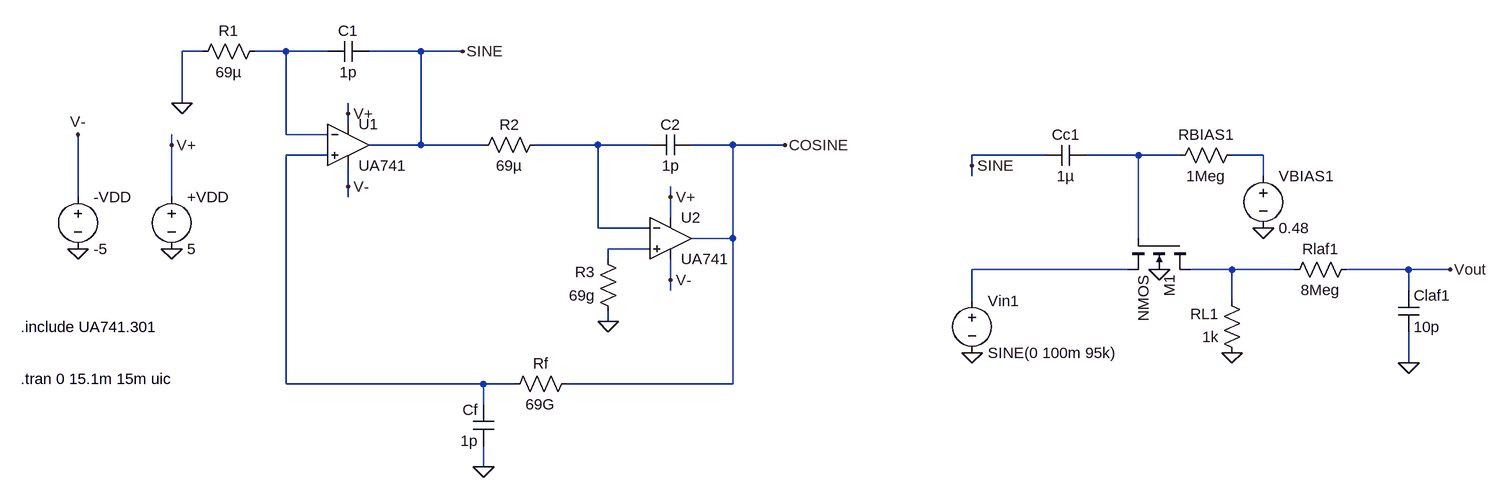
[diagram p0: schematic working!!!.asc]
working!!!.asc, the LTspice schematic file:
Version 4
SHEET 1 1844 704
WIRE -144 48 -176 48
WIRE -16 48 -64 48
WIRE 48 48 -16 48
WIRE 192 48 112 48
WIRE 256 48 192 48
WIRE -176 128 -176 48
WIRE 80 144 80 128
WIRE 80 160 80 144
WIRE -16 176 -16 48
WIRE 48 176 -16 176
WIRE -192 192 -192 176
WIRE 192 192 192 48
WIRE 192 192 112 192
WIRE 288 192 192 192
WIRE 464 192 368 192
WIRE 544 192 464 192
WIRE 672 192 608 192
WIRE 752 192 672 192
WIRE 48 208 -16 208
WIRE 1152 208 1040 208
WIRE 1296 208 1216 208
WIRE 1360 208 1296 208
WIRE 1488 208 1440 208
WIRE 1040 224 1040 208
WIRE 1040 240 1040 224
WIRE 1488 240 1488 208
WIRE 80 256 80 224
WIRE -336 272 -336 176
WIRE -192 272 -192 192
WIRE 80 272 80 256
WIRE 576 272 576 256
WIRE 576 304 576 272
WIRE 464 320 464 192
WIRE 544 320 464 320
WIRE 672 336 672 192
WIRE 672 336 608 336
WIRE 1296 336 1296 208
WIRE 544 352 480 352
WIRE 480 368 480 352
WIRE 1280 384 1040 384
WIRE 1440 384 1376 384
WIRE 1536 384 1440 384
WIRE 1712 384 1616 384
WIRE 1776 384 1712 384
WIRE 576 400 576 368
WIRE 576 416 576 400
WIRE 1712 416 1712 384
WIRE 1040 432 1040 384
WIRE 1440 432 1440 384
WIRE 480 464 480 448
WIRE 1712 528 1712 480
WIRE -16 560 -16 208
WIRE 288 560 -16 560
WIRE 336 560 288 560
WIRE 672 560 672 336
WIRE 672 560 416 560
WIRE 288 592 288 560
WIRE 288 688 288 656
FLAG 288 688 0
FLAG -176 128 0
FLAG -336 352 0
FLAG -192 352 0
FLAG 256 48 SINE
FLAG 752 192 COSINE
FLAG 480 464 0
FLAG -336 176 V-
FLAG -192 192 V+
FLAG 80 144 V+
FLAG 80 256 V-
FLAG 576 272 V+
FLAG 576 400 V-
FLAG 1488 320 0
FLAG 1040 512 0
FLAG 1328 384 0
FLAG 1440 512 0
FLAG 1712 528 0
FLAG 1776 384 Vout
FLAG 1040 224 SINE
SYMBOL cap 112 32 R90
WINDOW 0 0 32 VBottom 2
WINDOW 3 32 32 VTop 2
SYMATTR InstName C1
SYMATTR Value 1p
SYMBOL cap 608 176 R90
WINDOW 0 0 32 VBottom 2
WINDOW 3 32 32 VTop 2
SYMATTR InstName C2
SYMATTR Value 1p
SYMBOL cap 304 656 R180
WINDOW 0 24 56 Left 2
WINDOW 3 24 8 Left 2
SYMATTR InstName Cf
SYMATTR Value 1p
SYMBOL res -48 32 R90
WINDOW 0 0 56 VBottom 2
WINDOW 3 32 56 VTop 2
SYMATTR InstName R1
SYMATTR Value 69µ
SYMBOL res 384 176 R90
WINDOW 0 0 56 VBottom 2
WINDOW 3 32 56 VTop 2
SYMATTR InstName R2
SYMATTR Value 69µ
SYMBOL res 496 464 R180
WINDOW 0 36 76 Left 2
WINDOW 3 36 40 Left 2
SYMATTR InstName R3
SYMATTR Value 69g
SYMBOL res 432 544 R90
WINDOW 0 0 56 VBottom 2
WINDOW 3 32 56 VTop 2
SYMATTR InstName Rf
SYMATTR Value 69G
SYMBOL voltage -336 256 R0
SYMATTR InstName -VDD
SYMATTR Value -5
SYMBOL voltage -192 256 R0
SYMATTR InstName +VDD
SYMATTR Value 5
SYMBOL OpAmps/opamp2 80 128 R0
SYMATTR InstName U1
SYMATTR Value UA741
SYMBOL OpAmps/opamp2 576 272 R0
SYMATTR InstName U2
SYMATTR Value UA741
SYMBOL voltage 1488 224 R0
SYMATTR InstName VBIAS1
SYMATTR Value 0.48
SYMBOL voltage 1040 416 R0
SYMATTR InstName Vin1
SYMATTR Value SINE(0 100m 95k)
SYMBOL nmos4 1376 336 R90
SYMATTR InstName M1
SYMATTR Value2 l=0.18u w=0.4u ad=0.18p as=0.18p pd=1.7u ps=1.7u
SYMBOL res 1456 192 R90
WINDOW 0 0 56 VBottom 2
WINDOW 3 32 56 VTop 2
SYMATTR InstName RBIAS1
SYMATTR Value 1Meg
SYMBOL res 1456 528 R180
WINDOW 0 36 76 Left 2
WINDOW 3 36 40 Left 2
SYMATTR InstName RL1
SYMATTR Value 1k
SYMBOL cap 1216 192 R90
WINDOW 0 0 32 VBottom 2
WINDOW 3 32 32 VTop 2
SYMATTR InstName Cc1
SYMATTR Value 1µ
SYMBOL res 1632 368 R90
WINDOW 0 0 56 VBottom 2
WINDOW 3 32 56 VTop 2
SYMATTR InstName Rlaf1
SYMATTR Value 8Meg
SYMBOL cap 1696 416 R0
SYMATTR InstName Claf1
SYMATTR Value 10p
TEXT -424 472 Left 2 !.include UA741.301
TEXT -424 552 Left 2 !.tran 0 15.1m 15m uic

The netlist it stands for:
* working!!!.asc
C1 SINE N001 1p
C2 COSINE N002 1p
Cf 0 N003 1p
R1 N001 0 69µ
R2 N002 SINE 69µ
R3 0 N006 69g
Rf COSINE N003 69G
V§-VDD V- 0 -5
V§+VDD V+ 0 5
XU1 N003 N001 V+ V- SINE UA741  ; pins In+ In- V+ V- OUT
XU2 N006 N002 V+ V- COSINE UA741  ; pins In+ In- V+ V- OUT
VBIAS1 N005 0 0.48
Vin1 N007 0 SINE(0 100m 95k)
M1 N008 N004 N007 0 NMOS l=0.18u w=0.4u ad=0.18p as=0.18p pd=1.7u ps=1.7u
RBIAS1 N005 N004 1Meg
RL1 0 N008 1k
Cc1 N004 SINE 1µ
Rlaf1 Vout N008 8Meg
Claf1 Vout 0 10p
.model NMOS NMOS
.model PMOS PMOS
.lib standard.mos
.include UA741.301
.tran 0 15.1m 15m uic
.backanno
.end